# Altium schematic sheet Tj_Monitor.SchDoc
size A
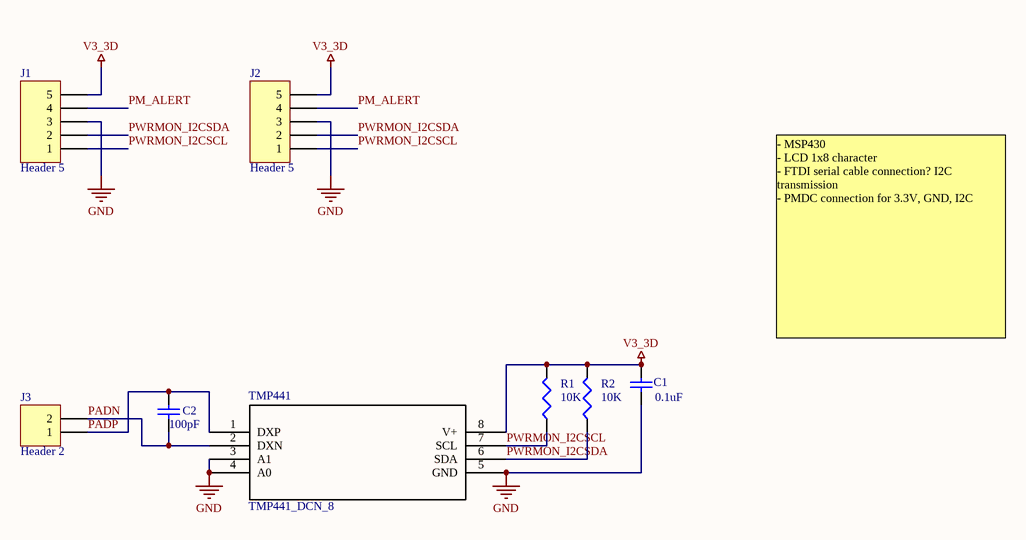
[diagram p0: Tj_Monitor.SchDoc]

## Parts
C1  value 0.1uF  [0402]  (hidden comment: Cap Semi)
C2  value 100pF  [0402]  (hidden comment: Cap Semi)
J1  Header 5  [HDR1X5]
J2  Header 5  [HDR1X5]
J3  Header 2  [HDR1X2]
R1  value 10K  [0402]  (hidden comment: Res3)
R2  value 10K  [0402]  (hidden comment: Res3)
TMP441  TMP441_DCN_8  [DCN8-L]

## Nets
GND: C1.1 J1.3 J2.3 TMP441.3(A1) TMP441.4(A0) TMP441.5(GND)
V3_3D: C1.2 J1.5 J2.5 R1.2 R2.2 TMP441.8(V+)
PADN: C2.1 J3.2 TMP441.2(DXN)
PADP: C2.2 J3.1 TMP441.1(DXP)
PM_ALERT: J1.4 J2.4
PWRMON_I2CSCL: J1.1 J2.1 R1.1 TMP441.7(SCL)
PWRMON_I2CSDA: J1.2 J2.2 R2.1 TMP441.6(SDA)

## Notes on the sheet
- - MSP430
  - LCD 1x8 character
  - FTDI serial cable connection? I2C transmission
  - PMDC connection for 3.3V, GND, I2C

## Library data of the parts
C1 C2 = Cap Semi: Capacitor (Semiconductor SIM Model); Published: 8-Jun-2000; LatestRevisionDate: 29-May-2009; LatestRevisionNote: IPC-7351 Footprint Added.; PackageReference: C1206; Publisher: Altium Limited; PackageDescription: Chip Capacitor
J1 J2 = Header 5: Header, 5-Pin; LatestRevisionDate: 17-Jul-2002; LatestRevisionNote: Re-released for DXP Platform.; Publisher: Altium Limited
J3 = Header 2: Header, 2-Pin; LatestRevisionDate: 17-Jul-2002; LatestRevisionNote: Re-released for DXP Platform.; Publisher: Altium Limited
R1 R2 = Res3: Resistor; Published: 8-Jun-2000; LatestRevisionDate: 29-May-2009; LatestRevisionNote: IPC-7351 Footprint Added.; PackageReference: J1-0603; Publisher: Altium Limited; PackageDescription: Chip Resistor
TMP441 = TMP441_DCN_8: Imported; GENERIC_PART_NUMBER: TMP441; Vendor: Texas Instruments; PACKAGE_DESIGNATOR: DCN; PIN_COUNT: 8; FAMILY_NAME: TEMPERATURE SENSOR; INDUSTRY_STD_PKG_TYPE: SOT-23; Manufacturer_Part_Number: tmp441_dcn_8; Datasheet URL: http://www.ti.com/lit/gpn/TMP441; Manufacturer: Texas Instruments; RefDes: RefDes; Type: DEV; Value: Value